# EAGLE schematic Wiring_25112019 (EAGLE 9.5.0)
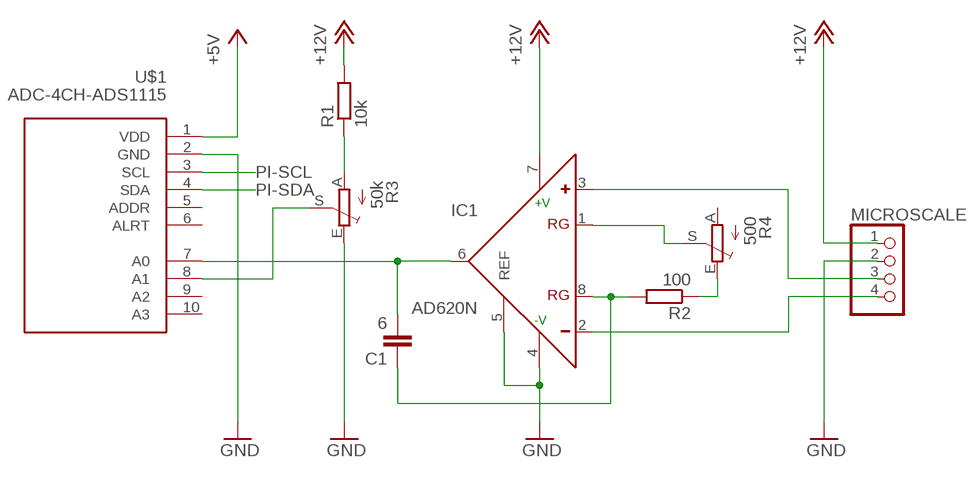
[diagram p0: schematic, sheet 1]

## Parts
C1  6  C-EU025-024X044  [C025-024X044]
IC1  AD620N  [DIL08]
MICROSCALE  PINHD-1X4  [1X04]
R1  10k  R-EU_0204/5  [0204/5]
R2  100  R-EU_0204/5  [0204/5]
R3  50k  TRIM_EU-LI10  [LI10]
R4  500  TRIM_EU-LI10  [LI10]
U$1  ADC-4CH-ADS1115  [ADC-4CH-ADS1115]

## Nets
+5V: U$1.1(VDD)
+12V: IC1.7(+V) MICROSCALE.1 R1.2
GND: IC1.4(-V) IC1.5(REF) MICROSCALE.2 R3.E U$1.2(GND)
N$1: C1.2 IC1.6(OUT) U$1.7(A0)
N$2: C1.1 IC1.8(RG) R2.2
N$3: IC1.1(RG) R4.S
N$4: R2.1 R4.E
N$5: IC1.2(-) MICROSCALE.4
N$6: IC1.3(+) MICROSCALE.3
N$7: R1.1 R3.A
N$8: R3.S U$1.8(A1)
PI-SCL: U$1.3(SCL)
PI-SDA: U$1.4(SDA)
Unconnected: R4.A U$1.5(ADDR) U$1.6(ALRT) U$1.9(A2) U$1.10(A3)

## Library data of the parts
C1 = rcl:C-EU: CAPACITOR, European symbol
IC1 = analog-devices:AD620: Low Cost, Low Power, Instrumentation Amplifier Source: http://www.analog.com/UploadedFiles/Data_Sheets/37793330023930AD620_e.pdf; MF: ALTERA CORPORATION; MPN: AD620AN; OC_FARNELL: 1523782; OC_NEWARK: 05F7108
MICROSCALE = pinhead:PINHD-1X4: PIN HEADER
R1 R2 = rcl:R-EU_: RESISTOR, European symbol
R3 R4 = pot:TRIM_EU-: POTENTIOMETER
U$1 = diy-modules:ADC-4CH-ADS1115: 4 Channel 16-Bit Analog-to-Digital Converter based on ADS1115 chip Arduino ADS1115 Getting Started Tutorial is available here: http://henrysbench.capnfatz.com/henrys-bench/arduino-voltage-measurements/arduino-ads1115-module-getting-started-tutorial/ ADS1115 datasheet is available here: http://www.ti.com/lit/ds/symlink/ads1115.pdf Click here to find device on ebay.com <http://www.ebay.com/sch/ads1115+module>